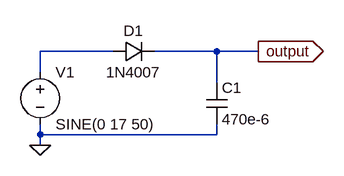
[diagram p0: schematic half_wave_rectifier.asc]
half_wave_rectifier.asc, the LTspice schematic file:
Version 4
SHEET 1 880 680
WIRE 192 96 80 96
WIRE 352 96 256 96
WIRE 416 96 352 96
WIRE 80 128 80 96
WIRE 352 144 352 96
WIRE 80 224 80 208
WIRE 352 224 352 208
WIRE 352 224 80 224
WIRE 80 240 80 224
FLAG 80 240 0
FLAG 416 96 output
IOPIN 416 96 Out
SYMBOL voltage 80 112 R0
WINDOW 123 0 0 Left 0
WINDOW 39 0 0 Left 0
SYMATTR InstName V1
SYMATTR Value SINE(0 17 50)
SYMBOL diode 192 112 R270
WINDOW 0 32 32 VTop 2
WINDOW 3 0 32 VBottom 2
SYMATTR InstName D1
SYMATTR Value 1N4007
SYMBOL cap 336 144 R0
SYMATTR InstName C1
SYMATTR Value 470e-6

The netlist it stands for:
* half_wave_rectifier.asc
V1 N001 0 SINE(0 17 50)
D1 N001 output 1N4007
C1 output 0 470e-6
.model D D
.lib standard.dio
.backanno
.end